# Altium schematic sheet MCU.SchDoc
size A4; SheetNumber: 1; SheetTotal: 2
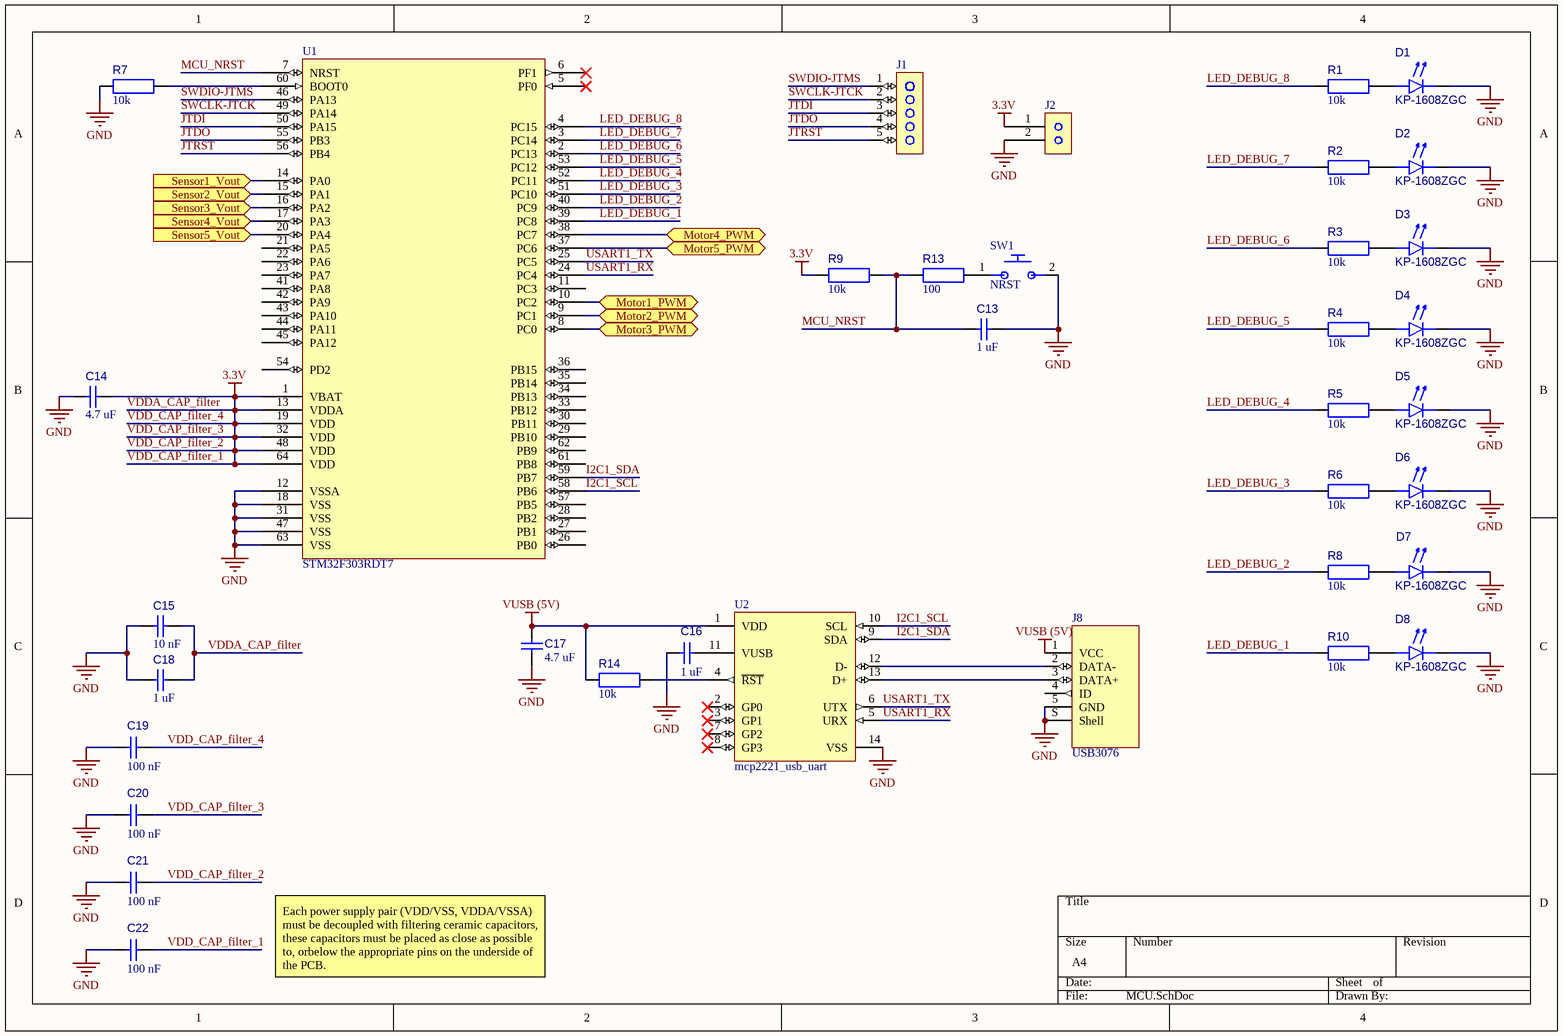
[diagram p0: MCU.SchDoc]

## Parts
C13  Capacitance: 1 uF  [CAPC1608X08N]  (hidden comment: Capacitor 0603 generic)
C14  Capacitance: 4.7 uF  [CAPC1608X08N]  (hidden comment: Capacitor 0603 generic)
C15  Capacitance: 10 nF  [CAPC1608X08N]  (hidden comment: Capacitor 0603 generic)
C16  Capacitance: 1 uF  [CAPC1608X08N]  (hidden comment: Capacitor 0603 generic)
C17  Capacitance: 4.7 uF  [CAPC1608X08N]  (hidden comment: Capacitor 0603 generic)
C18  Capacitance: 1 uF  [CAPC1608X08N]  (hidden comment: Capacitor 0603 generic)
C19  Capacitance: 100 nF  [CAPC1608X08N]  (hidden comment: Capacitor 0603 generic)
C20  Capacitance: 100 nF  [CAPC1608X08N]  (hidden comment: Capacitor 0603 generic)
C21  Capacitance: 100 nF  [CAPC1608X08N]  (hidden comment: Capacitor 0603 generic)
C22  Capacitance: 100 nF  [CAPC1608X08N]  (hidden comment: Capacitor 0603 generic)
D1  KP-1608ZGC  [DIOM1608X11N]
D2  KP-1608ZGC  [DIOM1608X11N]
D3  KP-1608ZGC  [DIOM1608X11N]
D4  KP-1608ZGC  [DIOM1608X11N]
D5  KP-1608ZGC  [DIOM1608X11N]
D6  KP-1608ZGC  [DIOM1608X11N]
D7  KP-1608ZGC  [DIOM1608X11N]
D8  KP-1608ZGC  [DIOM1608X11N]
J1  Header-2.54-ZL201-05G  [Header-2.54-ZL201-05G-Footprint-1]  (value not drawn)
J2  2_pin_f_2_54  [2_pin_f_2_54-Footprint-1]  (value not drawn)
J8  USB3076  [USB3076-XX-X_revC]
R1  Resistance: 10k  [RESC1608X04N]  (hidden comment: Resistor 0603 generic)
R2  Resistance: 10k  [RESC1608X04N]  (hidden comment: Resistor 0603 generic)
R3  Resistance: 10k  [RESC1608X04N]  (hidden comment: Resistor 0603 generic)
R4  Resistance: 10k  [RESC1608X04N]  (hidden comment: Resistor 0603 generic)
R5  Resistance: 10k  [RESC1608X04N]  (hidden comment: Resistor 0603 generic)
R6  Resistance: 10k  [RESC1608X04N]  (hidden comment: Resistor 0603 generic)
R7  Resistance: 10k  [RESC1608X04N]  (hidden comment: Resistor 0603 generic)
R8  Resistance: 10k  [RESC1608X04N]  (hidden comment: Resistor 0603 generic)
R9  Resistance: 10k  [RESC1608X04N]  (hidden comment: Resistor 0603 generic)
R10  Resistance: 10k  [RESC1608X04N]  (hidden comment: Resistor 0603 generic)
R13  Resistance: 100  [RESC1608X04N]  (hidden comment: Resistor 0603 generic)
R14  Resistance: 10k  [RESC1608X04N]  (hidden comment: Resistor 0603 generic)
SW1  NRST  [Button 6mm tht-Footprint-1]
U1  STM32F303RDT7  [LQFP50P1235X1235X165-64N]
U2  mcp2221_usb_uart  [FP-C04-065-SL-IPC_B]

## Ports
Motor1_PWM (bidir, see Signal_and_supply[2A]), Motor2_PWM (bidir, see Signal_and_supply[2A]), Motor3_PWM (bidir, see Signal_and_supply[2A]), Motor4_PWM (bidir, see Signal_and_supply[2A]), Motor5_PWM (bidir, see Signal_and_supply[2A]), Sensor1_Vout (in, see Signal_and_supply[4A]), Sensor2_Vout (in, see Signal_and_supply[4B]), Sensor3_Vout (in, see Signal_and_supply[4B]), Sensor4_Vout (in, see Signal_and_supply[4C]), Sensor5_Vout (in, see Signal_and_supply[4C])

## Nets
GND: C13.1 C14.2 C15.2 C16.2 C17.2 C18.2 C19.2 C20.2 C21.2 C22.2 D1.1(-) D2.1(-) D3.1(-) D4.1(-) D5.1(-) D6.1(-) D7.1(-) D8.1(-) J2.2(GND) J8.5(GND) J8.S(Shell) R7.1 SW1.2 U1.12(VSSA) U1.18(VSS) U1.31(VSS) U1.47(VSS) U1.63(VSS) U2.14(VSS)
VDD_CAP_filter_1: C14.1 C15.1 C18.1 C19.1 C20.1 C21.1 C22.1 J2.1(VDD) R9.1 U1.1(VBAT) U1.13(VDDA) U1.19(VDD) U1.32(VDD) U1.48(VDD) U1.64(VDD)  [also labelled 3.3V, VDD_CAP_filter_2, VDD_CAP_filter_3, VDD_CAP_filter_4, VDDA_CAP_filter]
VUSB (5V): C17.1 J8.1(VCC) R14.2 U2.1(VDD)
I2C1_SCL: U1.58(PB6) U2.10(SCL)
I2C1_SDA: U1.59(PB7) U2.9(SDA)
JTDI: J1.3 U1.50(PA15)
JTDO: J1.4 U1.55(PB3)
JTRST: J1.5 U1.56(PB4)
LED_DEBUG_1: R10.1 U1.39(PC8)
LED_DEBUG_2: R8.1 U1.40(PC9)
LED_DEBUG_3: R6.1 U1.51(PC10)
LED_DEBUG_4: R5.1 U1.52(PC11)
LED_DEBUG_5: R4.1 U1.53(PC12)
LED_DEBUG_6: R3.1 U1.2(PC13)
LED_DEBUG_7: R2.1 U1.3(PC14)
LED_DEBUG_8: R1.1 U1.4(PC15)
MCU_NRST: C13.2 R9.2 R13.1 U1.7(NRST)
Motor1_PWM: U1.10(PC2) ; port Motor1_PWM
Motor2_PWM: U1.9(PC1) ; port Motor2_PWM
Motor3_PWM: U1.8(PC0) ; port Motor3_PWM
Motor4_PWM: U1.38(PC7) ; port Motor4_PWM
Motor5_PWM: U1.37(PC6) ; port Motor5_PWM
Sensor1_Vout: U1.14(PA0) ; port Sensor1_Vout
Sensor2_Vout: U1.15(PA1) ; port Sensor2_Vout
Sensor3_Vout: U1.16(PA2) ; port Sensor3_Vout
Sensor4_Vout: U1.17(PA3) ; port Sensor4_Vout
Sensor5_Vout: U1.20(PA4) ; port Sensor5_Vout
SWCLK-JTCK: J1.2 U1.49(PA14)
SWDIO-JTMS: J1.1 U1.46(PA13)
USART1_RX: U1.24(PC4) U2.5(URX)
USART1_TX: U1.25(PC5) U2.6(UTX)
NetC16_1: C16.1 U2.11(VUSB)
NetD1_2: D1.2(+) R1.2
NetD2_2: D2.2(+) R2.2
NetD3_2: D3.2(+) R3.2
NetD4_2: D4.2(+) R4.2
NetD5_2: D5.2(+) R5.2
NetD6_2: D6.2(+) R6.2
NetD7_2: D7.2(+) R8.2
NetD8_2: D8.2(+) R10.2
NetJ8_2: J8.2(DATA-) U2.12(D-)
NetJ8_3: J8.3(DATA+) U2.13(D+)
NetR7_2: R7.2 U1.60(BOOT0)
NetR13_2: R13.2 SW1.1
NetR14_1: R14.1 U2.4(~{RST})

Not connected (* = marked no-connect by the designer): J8 4(ID); U1 5(PF0)* 6(PF1)* 11(PC3) 21(PA5) 22(PA6) 23(PA7) 26(PB0) 27(PB1) 28(PB2) 29(PB10) 30(PB11) 33(PB12) 34(PB13) 35(PB14) 36(PB15) 41(PA8) 42(PA9) 43(PA10) 44(PA11) 45(PA12) 54(PD2) 57(PB5) 61(PB8) 62(PB9); U2 2(GP0)* 3(GP1)* 7(GP2)* 8(GP3)*

## Notes on the sheet
- Each power supply pair (VDD/VSS, VDDA/VSSA) must be decoupled with filtering ceramic capacitors, these capacitors must be placed as close as possible to, orbelow the appropriate pins on the underside of the PCB.

## Library data of the parts
C13-C22 = CMP-001-00083-2: Generic 0603 capacitor. No set voltage/capacitance rating.
D1-D8 = CMP-007-00036-1: Single Color LED, Green, Water Clear, 1.2mm; Forward Current: 25mA; Max Operating Temperature: 85°C; RoHS Compliant: Yes; Min Operating Temperature: -40°C; Pins: 2; Mounting Technology: Surface Mount
J1 = CMP-00028-00007-3: Male header, pitch 2.54 mm, 1x5 pins
J2 = CMP-00028-00011-1: 2 pin female header, 2.54 mm pitch.
J8 = CMP-003-000000-4: Micro USB Receptacle, Type B, SMT, Horizontal, Bottom Mount, without Peg, with Outer Shell Stakes, without Mating Face Lead-In; Pin Count: 6; Source: USB3076-XX-X_revC.SchLib; Design Item ID: USB3076-XX-X_revC; Component Type: Standard
R1-R10 R13 R14 = CMP-009-00177-2: Generic 0603 resistor, no fixed value.
SW1 = CMP-00028-00009-2: Button 6mm tht; Pins: 2
U1 = CMP-020-00023-3: ARM Microcontroller, 32-Bit, FLASH, CORTEX-M4F CPU, 72MHz, CMOS, LQFP64; Interface: I2C,SPI,USB,CAN,I2S,IrDA,UART,USART,LIN; Case/Package: LQFP; Pins: 64; Min Operating Temperature: -40°C; Max Operating Temperature: 105°C; RoHS Compliant: Yes
U2 = CMP-015-00009-2: Usb uart converter.; Max Supply Voltage: 5.5V; Min Supply Voltage: 3V; Nominal Supply Voltage: 3.3V; Min Operating Temperature: -40°C; Pins: 14; Max Operating Temperature: 85°C; RoHS Compliant: Yes; Case/Package: SOP